# EAGLE schematic esquematico-educaino-V2 (EAGLE 7.6.0)
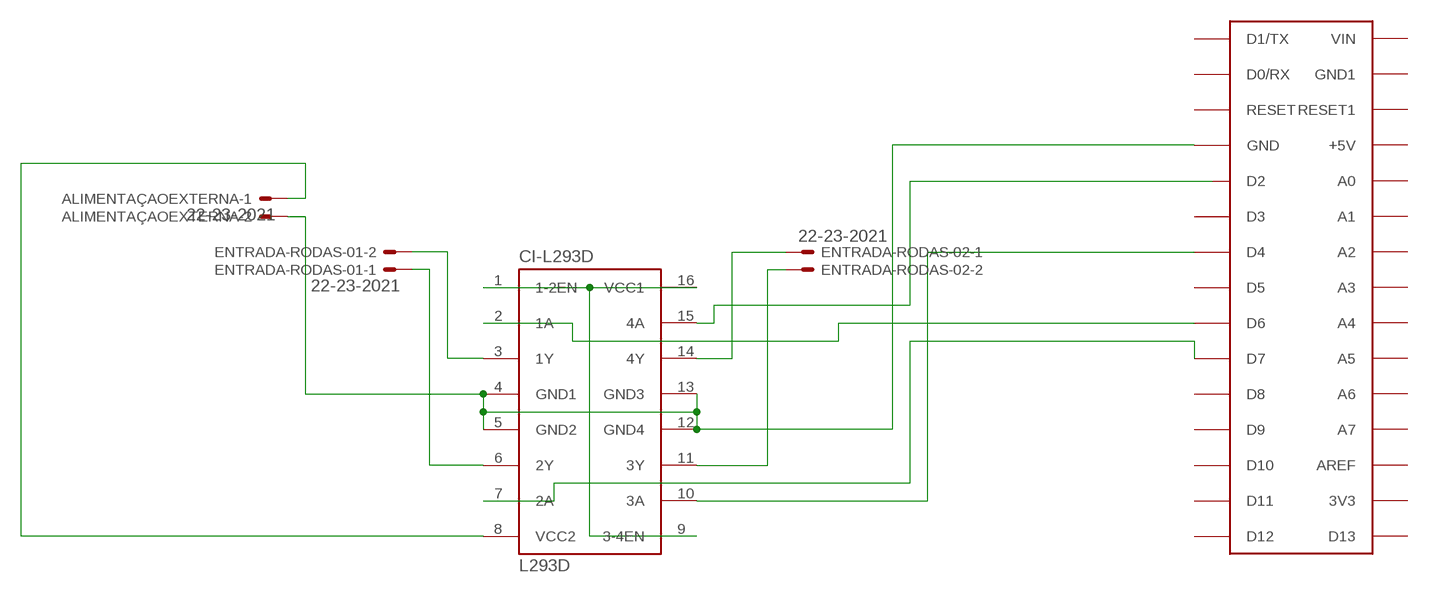
[diagram p0: schematic, sheet 1]

## Parts
ALIMENTAÇAOEXTERNA  22-23-2021  [22-23-2021]
CI-L293D  L293D  [DIL16]
ENTRADA-RODAS-01  22-23-2021  [22-23-2021]
ENTRADA-RODAS-02  22-23-2021  [22-23-2021]
U$1  ARDUINONANO  [PDIP-32]

## Nets
N$1: ALIMENTAÇAOEXTERNA.2 CI-L293D.4(GND1) CI-L293D.5(GND2) CI-L293D.12(GND4) CI-L293D.13(GND3) U$1.GND
N$3: CI-L293D.3(1Y) ENTRADA-RODAS-01.2
N$4: CI-L293D.1(1-2EN) CI-L293D.9(3-4EN) CI-L293D.16(VCC1)
N$5: ALIMENTAÇAOEXTERNA.1 CI-L293D.8(VCC2)
N$6: CI-L293D.6(2Y) ENTRADA-RODAS-01.1
N$7: CI-L293D.14(4Y) ENTRADA-RODAS-02.1
N$8: CI-L293D.11(3Y) ENTRADA-RODAS-02.2
N$9: CI-L293D.2(1A) U$1.D6
N$10: CI-L293D.7(2A) U$1.D7
N$11: CI-L293D.15(4A)
N$12: CI-L293D.10(3A) U$1.D4
Unconnected: U$1.3V3 U$1.+5V U$1.A0 U$1.A1 U$1.A2 U$1.A3 U$1.A4 U$1.A5 U$1.A6 U$1.A7 U$1.AREF U$1.D0/RX U$1.D1/TX U$1.D2 U$1.D3 U$1.D5 U$1.D8 U$1.D9 U$1.D10 U$1.D11 U$1.D12 U$1.D13 U$1.GND1 U$1.RESET U$1.RESET1 U$1.VIN

## Library data of the parts
ALIMENTAÇAOEXTERNA ENTRADA-RODAS-01 ENTRADA-RODAS-02 = con-molex:22-23-2021: .100" (2.54mm) Center Header - 2 Pin; MF: MOLEX; MPN: 22-23-2021; OC_FARNELL: 1462926; OC_NEWARK: 25C3832
CI-L293D = st-microelectronics:L293D: PUSH-PULL 4 CHANNEL DRIVER; MPN: L293D; OC_FARNELL: 9589619; OC_NEWARK: 56P8249
U$1 = jet-lib:ARDUINONANO